# Altium schematic sheet EasyRideOS_Altuim_schematic.SchDoc
size A4; SheetNumber: 1; SheetTotal: 1
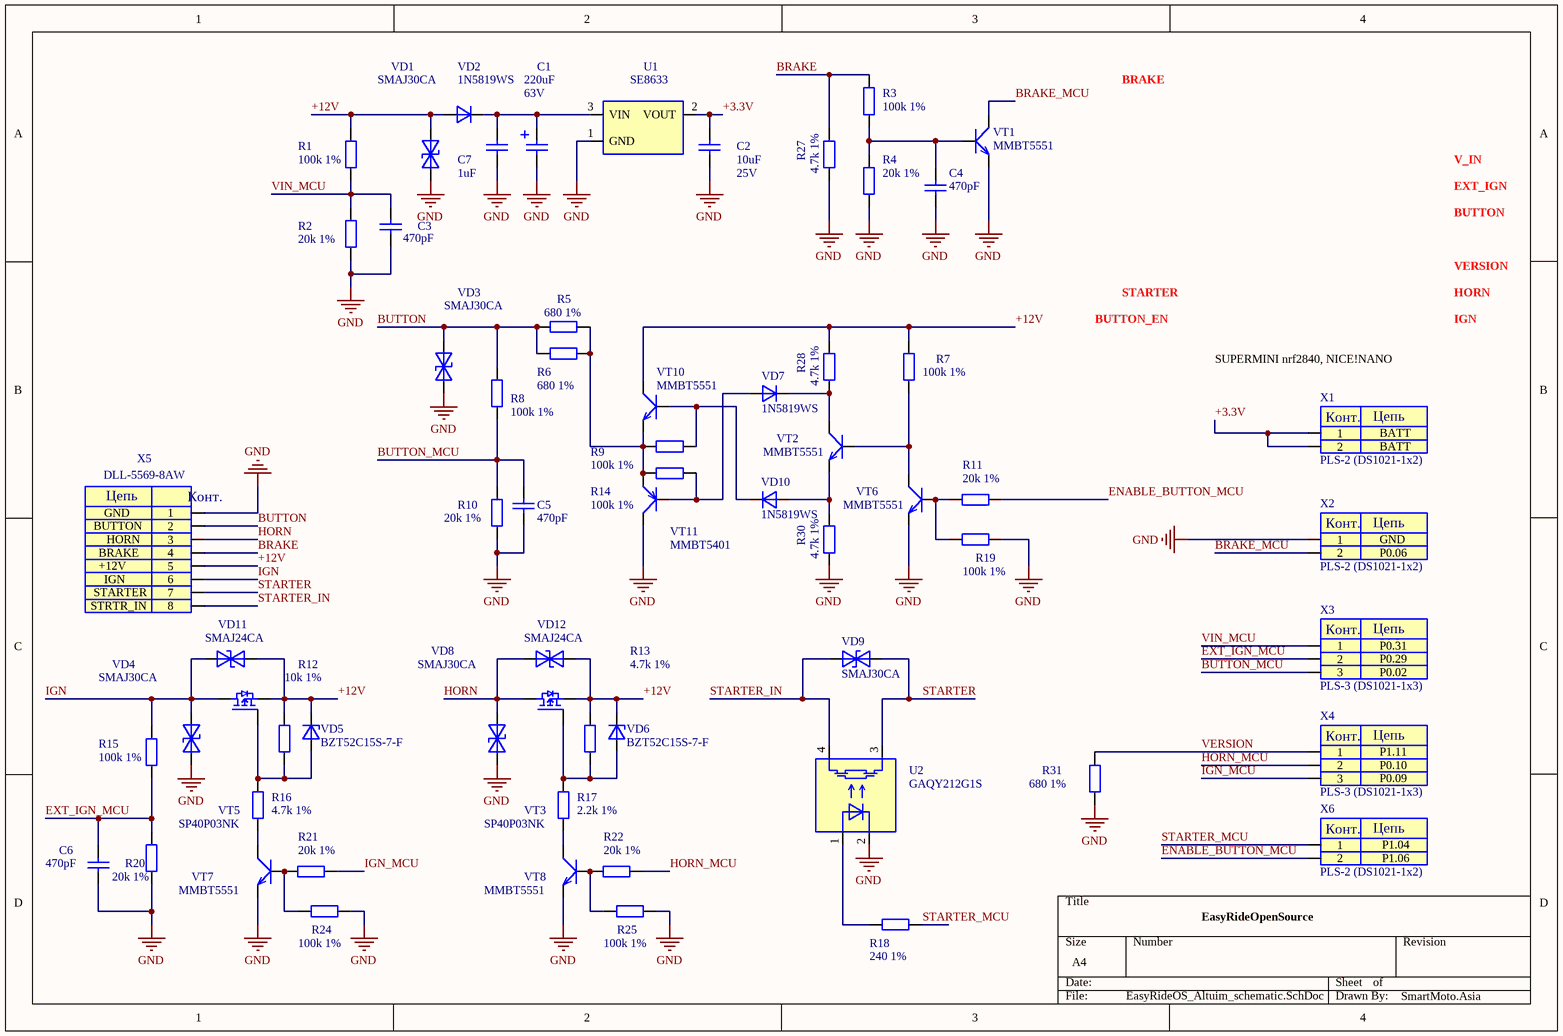
[diagram p0: EasyRideOS_Altuim_schematic.SchDoc]

## Parts
C1  value 220uF  Voltage Rating: 63V  [SMD_AL_10x12.6_(Size code F12)]  (hidden comment: 220uF 63V)
C2  value 10uF  Voltage Rating: 25V  [CAP0603]  (hidden comment: 0603 10uF 25V)
C3  value 470pF  [CAP0603]  (hidden comment: 0603 470pF 50V)
C4  value 470pF  [CAP0603]  (hidden comment: 0603 470pF 50V)
C5  value 470pF  [CAP0603]  (hidden comment: 0603 470pF 50V)
C6  value 470pF  [CAP0603]  (hidden comment: 0603 470pF 50V)
C7  value 1uF  [CAP0603]  (hidden comment: 0603 1uF 50V)
R1  value 100k 1%  [RES0603]  (hidden comment: 0603 100k 1%)
R2  value 20k 1%  [RES0603]  (hidden comment: 0603 20k 1%)
R3  value 100k 1%  [RES0603]  (hidden comment: 0603 100k 1%)
R4  value 20k 1%  [RES0603]  (hidden comment: 0603 20k 1%)
R5  value 680 1%  [RES0603]  (hidden comment: 0603 680 1%)
R6  value 680 1%  [RES0603]  (hidden comment: 0603 680 1%)
R7  value 100k 1%  [RES0603]  (hidden comment: 0603 100k 1%)
R8  value 100k 1%  [RES0603]  (hidden comment: 0603 100k 1%)
R9  value 100k 1%  [RES0603]  (hidden comment: 0603 100k 1%)
R10  value 20k 1%  [RES0603]  (hidden comment: 0603 20k 1%)
R11  value 20k 1%  [RES0603]  (hidden comment: 0603 20k 1%)
R12  value 10k 1%  [RES0603]  (hidden comment: 0603 10k 1%)
R13  value 4.7k 1%  [RES0603]  (hidden comment: 0603 4.7k 1%)
R14  value 100k 1%  [RES0603]  (hidden comment: 0603 100k 1%)
R15  value 100k 1%  [RES0603]  (hidden comment: 0603 100k 1%)
R16  value 4.7k 1%  [RES0603]  (hidden comment: 0603 4.7k 1%)
R17  value 2.2k 1%  [RES0603]  (hidden comment: 0603 2.2k 1%)
R18  value 240 1%  [RES0603]  (hidden comment: 0603 240 1%)
R19  value 100k 1%  [RES0603]  (hidden comment: 0603 100k 1%)
R20  value 20k 1%  [RES0603]  (hidden comment: 0603 20k 1%)
R21  value 20k 1%  [RES0603]  (hidden comment: 0603 20k 1%)
R22  value 20k 1%  [RES0603]  (hidden comment: 0603 20k 1%)
R24  value 100k 1%  [RES0603]  (hidden comment: 0603 100k 1%)
R25  value 100k 1%  [RES0603]  (hidden comment: 0603 100k 1%)
R27  value 4.7k 1%  [RES0603]  (hidden comment: 0603 4.7k 1%)
R28  value 4.7k 1%  [RES0603]  (hidden comment: 0603 4.7k 1%)
R30  value 4.7k 1%  [RES0603]  (hidden comment: 0603 4.7k 1%)
R31  value 680 1%  [RES0603]  (hidden comment: 0603 680 1%)
U1  SE8633  [SOT-23-3]
U2  GAQY212G1S  [SOP-4]
VD1  SMAJ30CA  [DO-214AC (SMA)]
VD2  1N5819WS  [SOD-323]
VD3  SMAJ30CA  [DO-214AC (SMA)]
VD4  SMAJ30CA  [DO-214AC (SMA)]
VD5  BZT52C15S-7-F  [SOD-323]
VD6  BZT52C15S-7-F  [SOD-323]
VD7  1N5819WS  [SOD-323]
VD8  SMAJ30CA  [DO-214AC (SMA)]
VD9  SMAJ30CA  [DO-214AC (SMA)]
VD10  1N5819WS  [SOD-323]
VD11  SMAJ24CA  [DO-214AC (SMA)]
VD12  SMAJ24CA  [DO-214AC (SMA)]
VT1  MMBT5551  [SOT-23-3N]
VT2  MMBT5551  [SOT-23-3N]
VT3  SP40P03NK  [PPAK5*6-8L_(PDFN5*6)]
VT5  SP40P03NK  [PPAK5*6-8L_(PDFN5*6)]
VT6  MMBT5551  [SOT-23-3N]
VT7  MMBT5551  [SOT-23-3N]
VT8  MMBT5551  [SOT-23-3N]
VT10  MMBT5551  [SOT-23-3N]
VT11  MMBT5401  [SOT-23-3N]
X1  PLS-2 (DS1021-1x2)  [PLS-2 (DS1021-1x2)]
X2  PLS-2 (DS1021-1x2)  [PLS-2 (DS1021-1x2)]
X3  PLS-3 (DS1021-1x3)  [PLS-3 (DS1021-1X3)]
X4  PLS-3 (DS1021-1x3)  [PLS-3 (DS1021-1X3)]
X5  DLL-5569-8AW  [DLL-5569-8AW]
X6  PLS-2 (DS1021-1x2)  [PLS-2 (DS1021-1x2)]

## Nets
GND: C1.2 C2.1 C3.1 C4.2 C5.1 C6.2 C7.1 R2.1 R4.1 R10.1 R19.2 R20.1 R24.2 R25.2 R27.1 R30.1 R31.1 U1.1(GND) U2.2(C) VD1.2(A) VD3.2(A) VD4.2(A) VD8.2(A) VT1.2(E) VT6.2(E) VT7.2(E) VT8.2(E) VT11.3(IO) X2.1 X5.1
+3.3V: C2.2 U1.2(VOUT) X1.1 X1.2
+12V: R1.2 R7.2 R12.2 R13.2 R28.2 VD1.1(K) VD2.2 VD5.1 VD6.1 VD11.2(A) VD12.2(A) VT3.2(S) VT5.2(S) VT10.3(C) X5.5
BRAKE: R3.2 R27.2 X5.4
BRAKE_MCU: VT1.3(C) X2.2
BUTTON: R5.1 R6.1 R8.2 VD3.1(K) X5.2
BUTTON_MCU: C5.2 R8.1 R10.2 X3.3
ENABLE_BUTTON_MCU: R11.1 X6.2
EXT_IGN_MCU: C6.1 R15.1 R20.2 X3.2
HORN: VD8.1(K) VD12.1(K) VT3.3(D) X5.3
HORN_MCU: R22.1 X4.2
IGN: R15.2 VD4.1(K) VD11.1(K) VT5.3(D) X5.6
IGN_MCU: R21.1 X4.3
STARTER: U2.3(E) VD9.1(K) X5.7
STARTER_IN: U2.4(C) VD9.2(A) X5.8
STARTER_MCU: R18.2 X6.1
VERSION: R31.2 X4.1
VIN_MCU: C3.2 R1.1 R2.2 X3.1
NetC1_1: C1.1 C7.2 U1.3(VIN) VD2.1
NetC4_1: C4.1 R3.1 R4.2 VT1.1(B)
NetR5_2: R5.2 R6.2 R9.2 R14.2 VT10.2(E) VT11.2(IO)
NetR7_1: R7.1 VT2.1(B) VT6.3(C)
NetR9_1: R9.1 VD10.1 VT10.1(B)
NetR11_2: R11.2 R19.1 VT6.1(B)
NetR12_1: R12.1 R16.2 VD5.2 VT5.1(G)
NetR13_1: R13.1 R17.2 VD6.2 VT3.1(G)
NetR14_1: R14.1 VD7.2 VT11.1(IO)
NetR16_1: R16.1 VT7.3(C)
NetR17_1: R17.1 VT8.3(C)
NetR18_1: R18.1 U2.1(A)
NetR21_2: R21.2 R24.1 VT7.1(B)
NetR22_2: R22.2 R25.1 VT8.1(B)
NetR28_1: R28.1 VD7.1 VT2.3(C)
NetR30_2: R30.2 VD10.2 VT2.2(E)

## Notes on the sheet
- BRAKE
- V_IN
- EXT_IGN
- BUTTON
- STARTER
- HORN
- VERSION
- BUTTON_EN
- SUPERMINI nrf2840, NICE!NANO
- IGN
- BATT
- GND
- +12V
- P0.06
- (near X5) STRTR_IN
- P0.31
- P0.29
- P0.02
- P1.11
- P0.10
- P0.09
- P1.04
- (near X6) EasyRideOpenSource
- P1.06
- SmartMoto.Asia
- (in symbol DLL-5569-8AW) Цепь; Конт.
- (in symbol PLS-2 (DS1021-1x2)) Конт.; Цепь
- (in symbol PLS-3 (DS1021-1x3)) Конт.; Цепь

## Library data of the parts
C1 = SMD AL 330uF 50V 10x12.6_1: -55℃~+105℃ 10.2mm 10mm 2000hrs@105℃ 292mA@120Hz 330uF 50V ±20% SMD,D10xL10.2mm Aluminum Electrolytic Capacitors - SMD ROHS; Part Number: 189RV0038; ComponentLink1Description: Information; ComponentLink2Description: Datasheet; ComponentLink1URL: https://industrial.panasonic.com/ww/products/pt/os-con/models/50SVPF68M; ComponentLink2URL: https://industrial.panasonic.com/cdbs/www-data/pdf/AAB8000/AAB8000C177.pdf; Mounting Technology: SMT; Min Operating Temperature: -55°C; Case/Package: 10x10.6мм; Tolerance: 20%; Max Operating Temperature: 105°C; Parameter 1: *
C2 = 0603 4.7uF 25V: 10uF, 25V, ±10%, X5R, 0603; Part Number: CL10A106MA8NRNC; Capacitor Type: Ceramic; Max Operating Temperature: 85°C; RoHS Compliant: Yes; Min Operating Temperature: -55°C; Mounting Technology: SMD; Case/Package: 0603; Tolerance: 10%
C3-C6 = 0603 390pF 50V: 470pF, 50V, ±5%, X7R, 0603; Part Number: 0603B471K500NT; Capacitor Type: Ceramic; ComponentLink2Description: Information; Component Type: Standard; ComponentLink2URL: https://www.elitan.ru/price/item418250; Dielectric: X7R; Max Operating Temperature: 125°C; Tolerance: 5%; Mounting Technology: SMD; Min Operating Temperature: -55°C; RoHS Compliant: Yes; Case/Package: 0603; Voltage Rating: 50V
C7 = 0603 0.1uF 50V: 1uF, 50V, ±10%, X7R, 0603; Part Number: CL10A105KB8NNNC; Manufacturer: Murata; Capacitor Type: Ceramic; Dielectric: X7R; ComponentLink2URL: https://www.elitan.ru/price/item8634398; ComponentLink2Description: Information; Component Type: Standard; Max Operating Temperature: 125°C; Mounting Technology: SMD; Min Operating Temperature: -55°C; Pins: 2; Tolerance: 10%; RoHS Compliant: Yes; Case/Package: 0603; Voltage Rating: 50V
R1 R3 R7-R9 R14 R15 R19 R24 R25 = 0603 100k 1%: 0.1W, 75V, 100ppm/Cel, 1%; Part Number: 0603WAF1003T5E; Voltage Rating: 50V; Tolerance: 1%; ComponentLink1Description: Information; ComponentLink1URL: https://www.elitan.ru/price/item1190578
R2 R4 R10 R11 R20-R22 = 0603 20k 1%: 0.1W, 75V, 100ppm/Cel, 1%; Part Number: 0603WAF2002T5E; Voltage Rating: 50V; Tolerance: 1%; Min Operating Temperature: -55°C; Designators: 0603 20k 1%; Max Operating Temperature: 155°C
R5 R6 = 0603 4.7k 1%: 0.1W, 75V, 100ppm/Cel, 1%; Part Number: 0603WAF6800T5E; Voltage Rating: 50V; Case/Package: 0603; RoHS Compliant: Yes; Max Operating Temperature: 155°C; ComponentLink1URL: https://www.elitan.ru/price/item1613361; ComponentLink1Description: Information; Tolerance: 1%; Min Operating Temperature: -55°C
R12 = 0603 100k 1%: 0.1W, 75V, 100ppm/Cel, 1%; Part Number: 0603WAF1002T5E; Voltage Rating: 50V; Tolerance: 1%; ComponentLink1Description: Information; ComponentLink1URL: https://www.elitan.ru/price/item1190578
R13 = 0603 100k 1%: 0.1W, 75V, 100ppm/Cel, 1%; Part Number: 0603WAF4701T5E; Voltage Rating: 50V; Tolerance: 1%; ComponentLink1Description: Information; ComponentLink1URL: https://www.elitan.ru/price/item1190578
R16 = 0603 10k 1%: 0.1W, 75V, 100ppm/Cel, 1%; Part Number: 0603WAF4701T5E; Voltage Rating: 50V; ComponentLink1Description: Information; ComponentLink1URL: https://www.elitan.ru/price/item1612641; Min Operating Temperature: -55°C; ComponentLink2Description: Datasheet; ComponentLink2URL: https://ru.mouser.com/datasheet/2/54/crxxxxx-1858361.pdf; RoHS Compliant: Yes; Max Operating Temperature: 155°C; Tolerance: 1%
R17 = 0603 10k 1%: 0.1W, 75V, 100ppm/Cel, 1%; Part Number: 0603WAF2201T5E; Voltage Rating: 50V; ComponentLink1Description: Information; ComponentLink1URL: https://www.elitan.ru/price/item1612641; Min Operating Temperature: -55°C; ComponentLink2Description: Datasheet; ComponentLink2URL: https://ru.mouser.com/datasheet/2/54/crxxxxx-1858361.pdf; RoHS Compliant: Yes; Max Operating Temperature: 155°C; Tolerance: 1%
R18 = 0603 4.7k 1%: 0.1W, 75V, 100ppm/Cel, 1%; Part Number: 0603WAF2400T5E; Voltage Rating: 50V; Case/Package: 0603; RoHS Compliant: Yes; Max Operating Temperature: 155°C; ComponentLink1URL: https://www.elitan.ru/price/item1613361; ComponentLink1Description: Information; Tolerance: 1%; Min Operating Temperature: -55°C
R27 R28 R30 = 0603 4.7k 1%: 0.1W, 75V, 100ppm/Cel, 1%; Part Number: 0603WAF4701T5E; Voltage Rating: 50V; Case/Package: 0603; RoHS Compliant: Yes; Max Operating Temperature: 155°C; ComponentLink1URL: https://www.elitan.ru/price/item1613361; ComponentLink1Description: Information; Tolerance: 1%; Min Operating Temperature: -55°C
R31 = 0603 100k 1%: 0.1W, 75V, 100ppm/Cel, 1%; Part Number: 0603WAF6800T5E; Voltage Rating: 50V; Tolerance: 1%; ComponentLink1Description: Information; ComponentLink1URL: https://www.elitan.ru/price/item1190578
U1 = SE8633: LDO, 200mA, 60V, 0.3V Dropout, SOT23-3; Part Number: SE8633X2-HF
U2 = GAQY212G1S: -40℃~+85℃ 1.2V 1.3A 1.5kV 130mΩ 1ms 450mW 50mA 600us 60V AC,DC One set normally open: 2A (SPST - normally open) SOP-4 Solid State Relays (MOS Output) ROHS; Part Number: GAQY212G1S
VD1 VD3 VD4 VD8 VD9 = SMAJ30CA: TVS Diode, 400W, 30V V(RWM), Bidirectional, 1 Element, Silicon, DO-214AC; Part Number: SMAJ30CA; Value: 30V
VD2 VD7 VD10 = 1N4148WS: Rectifier Diode, 1 Phase, 1 Element, 0.15A, 75V V(RRM), Silicon, SOD-323; Part number: 1N5819WS
VD5 VD6 = BZT52C15S-7-F: 15V 200mW SOD-323; Part number: BZT52C15S-7-F; Value: 15V; ComponentLink1Description: Datasheet; ComponentLink1URL: https://www.vishay.com/docs/85760/bzt52.pdf
VD11 VD12 = SMAJ30CA: TVS Diode, 400W, 30V V(RWM), Bidirectional, 1 Element, Silicon, DO-214AC; Value: 24V; Part Number: SMAJ24CA
VT1 VT2 VT6-VT8 VT10 = BC817-25: NPN 0.5A 45V; Part Number: MMBT5551
VT3 VT5 = SP40P03NK: P-Channel 100A 60V 3 mOhm PDFN5x6; pin to pad: 1>4 2>1+2+3 3>5+6+7+8; Part Number: SP40P03NK
VT11 = BC807-40: PNP 0.5A 45V; Part Number: MMBT5401
X1 X2 X6 = PLS-2 (DS1021-1x2): Single Row Pin Header pitch 2.54mm, male; Part Number: DS1021-1x2SF11-B
X3 X4 = PLS-3 (DS1021-1x3): Single Row Pin Header pitch 2.54mm, male; Part Number: DS1021-1x3SF11-B
X5 = DLL-5569-8AW: -35℃~+105℃ 16P 2 2x4P 300V 4.2mm 5.5mm 8 9A Brass Mini-Fit(MX 4.2) PA66 Right Angle Tin Transparent UL94V-0 Push-Pull,P=4.2mm Wire To Board Connector ROHS; Mounting Technology: Hole; Case/Package: Mini-Fit; Max Current Rating: 9A; Pins: 8; ComponentLink1Description: Information; ComponentLink1URL: https://iarduino.ru/shop/radioparts/kontaktnye-kolodki-arduino.html; Part Number: DLL-5569-8AW